# EAGLE design WillowCape_v1 (EAGLE 7.3.0)
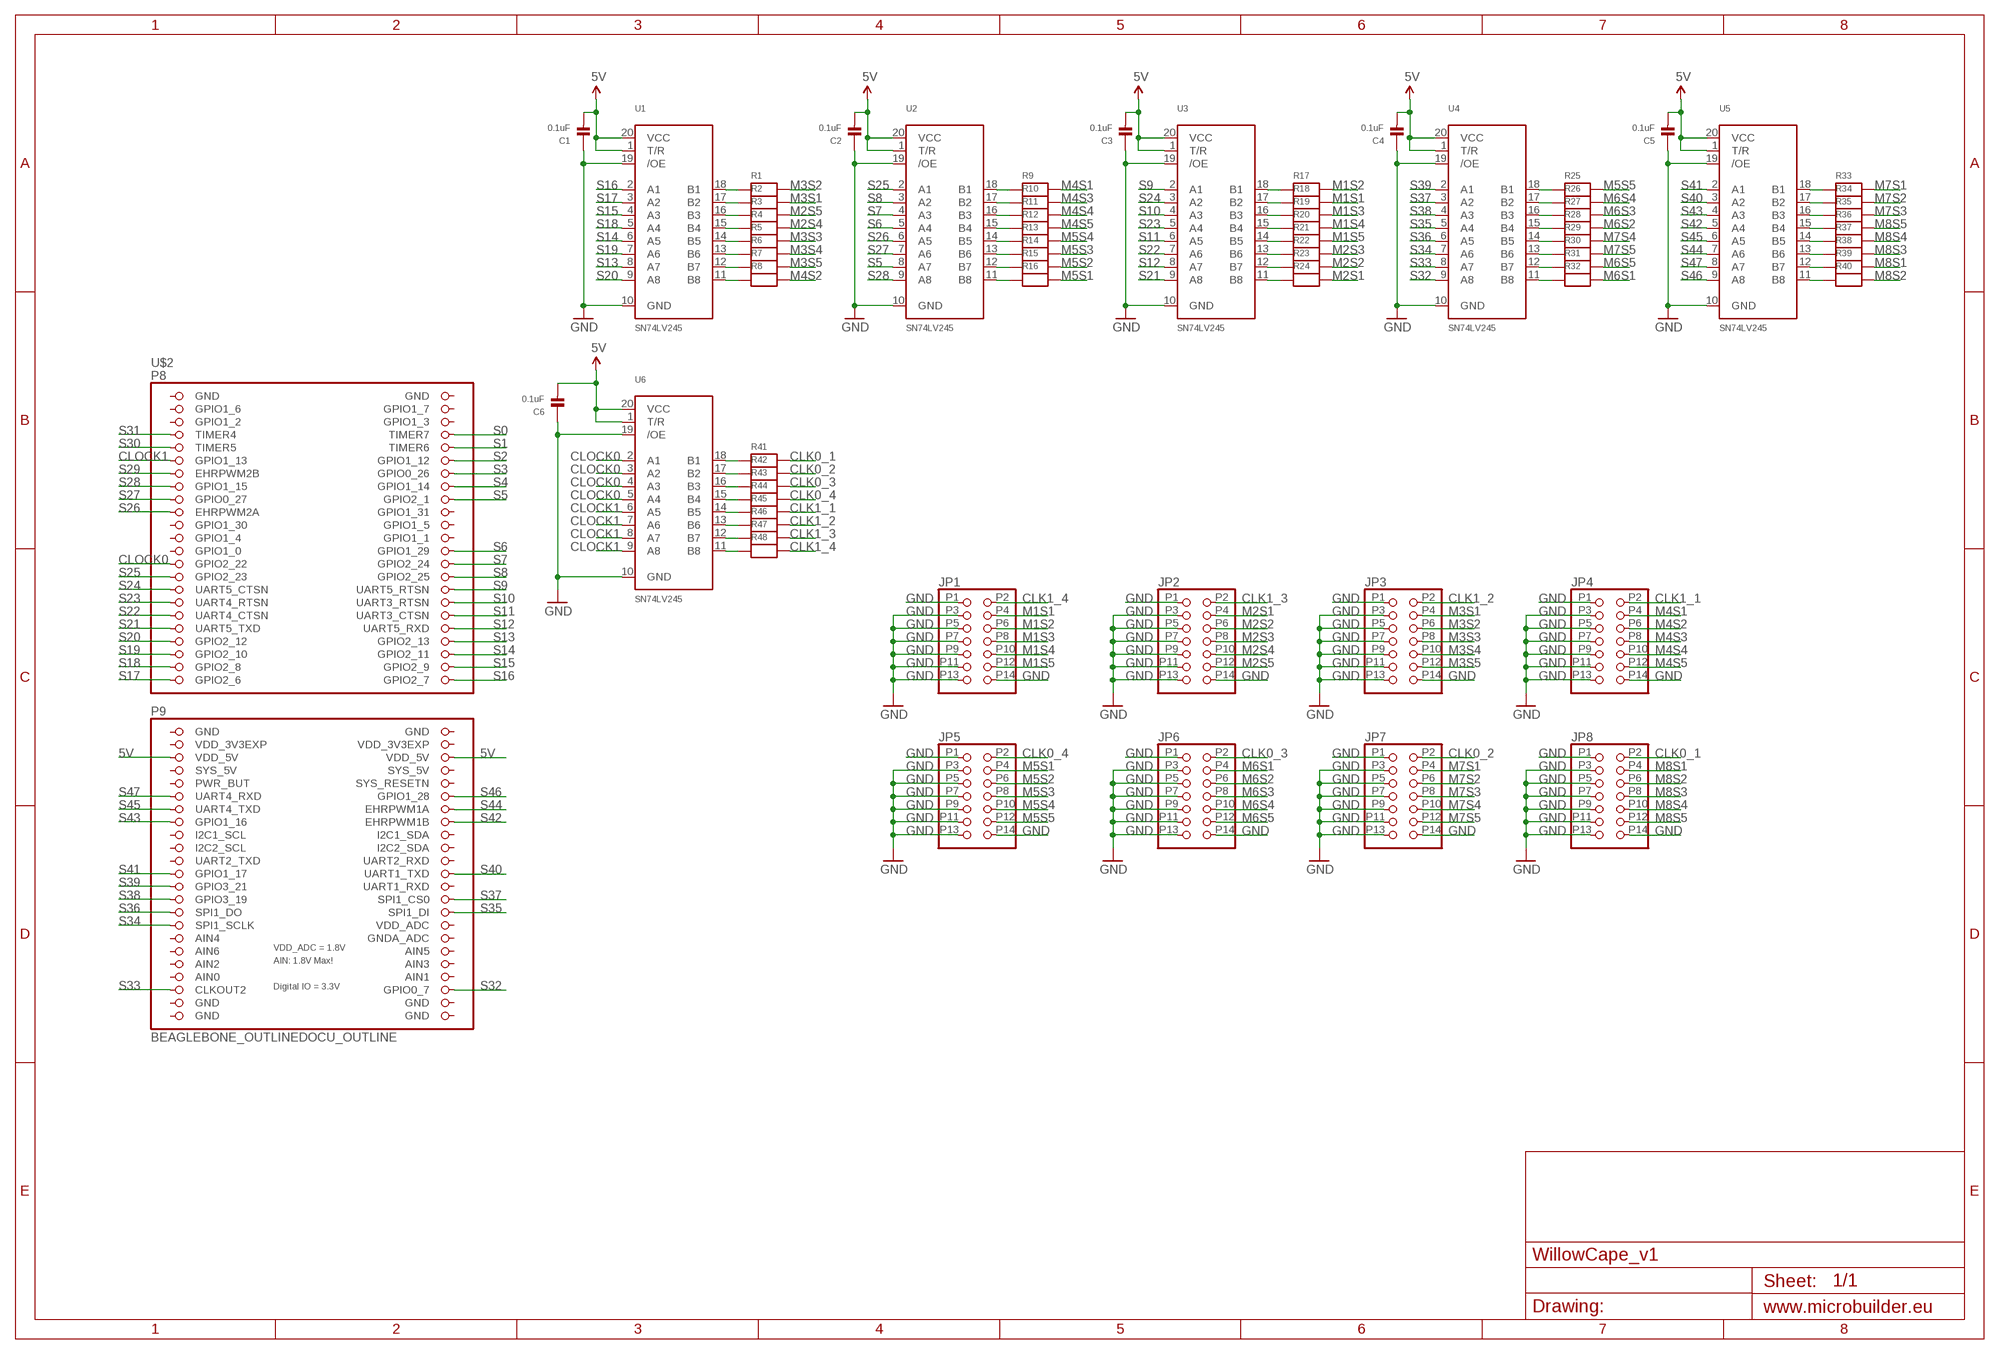
[diagram p0: schematic, sheet 1]

## Parts
C1  0.1uF  CAP_CERAMIC0603  [0603]
C2  0.1uF  CAP_CERAMIC0603  [0603]
C3  0.1uF  CAP_CERAMIC0603  [0603]
C4  0.1uF  CAP_CERAMIC0603  [0603]
C5  0.1uF  CAP_CERAMIC0603  [0603]
C6  0.1uF  CAP_CERAMIC0603  [0603]
JP1  IDC-BOX-HEADER  [IDC-BOX-HEADER]
JP2  IDC-BOX-HEADER  [IDC-BOX-HEADER]
JP3  IDC-BOX-HEADER  [IDC-BOX-HEADER]
JP4  IDC-BOX-HEADER  [IDC-BOX-HEADER]
JP5  IDC-BOX-HEADER  [IDC-BOX-HEADER]
JP6  IDC-BOX-HEADER  [IDC-BOX-HEADER]
JP7  IDC-BOX-HEADER  [IDC-BOX-HEADER]
JP8  IDC-BOX-HEADER  [IDC-BOX-HEADER]
R1  RESISTOR0603  [0603]
R2  RESISTOR0603  [0603]
R3  RESISTOR0603  [0603]
R4  RESISTOR0603  [0603]
R5  RESISTOR0603  [0603]
R6  RESISTOR0603  [0603]
R7  RESISTOR0603  [0603]
R8  RESISTOR0603  [0603]
R9  RESISTOR0603  [0603]
R10  RESISTOR0603  [0603]
R11  RESISTOR0603  [0603]
R12  RESISTOR0603  [0603]
R13  RESISTOR0603  [0603]
R14  RESISTOR0603  [0603]
R15  RESISTOR0603  [0603]
R16  RESISTOR0603  [0603]
R17  RESISTOR0603  [0603]
R18  RESISTOR0603  [0603]
R19  RESISTOR0603  [0603]
R20  RESISTOR0603  [0603]
R21  RESISTOR0603  [0603]
R22  RESISTOR0603  [0603]
R23  RESISTOR0603  [0603]
R24  RESISTOR0603  [0603]
R25  RESISTOR0603  [0603]
R26  RESISTOR0603  [0603]
R27  RESISTOR0603  [0603]
R28  RESISTOR0603  [0603]
R29  RESISTOR0603  [0603]
R30  RESISTOR0603  [0603]
R31  RESISTOR0603  [0603]
R32  RESISTOR0603  [0603]
R33  RESISTOR0603  [0603]
R34  RESISTOR0603  [0603]
R35  RESISTOR0603  [0603]
R36  RESISTOR0603  [0603]
R37  RESISTOR0603  [0603]
R38  RESISTOR0603  [0603]
R39  RESISTOR0603  [0603]
R40  RESISTOR0603  [0603]
R41  RESISTOR0603  [0603]
R42  RESISTOR0603  [0603]
R43  RESISTOR0603  [0603]
R44  RESISTOR0603  [0603]
R45  RESISTOR0603  [0603]
R46  RESISTOR0603  [0603]
R47  RESISTOR0603  [0603]
R48  RESISTOR0603  [0603]
U1  SN74LV245  74LCX245  [TSSOP20]
U2  SN74LV245  74LCX245  [TSSOP20]
U3  SN74LV245  74LCX245  [TSSOP20]
U4  SN74LV245  74LCX245  [TSSOP20]
U5  SN74LV245  74LCX245  [TSSOP20]
U6  SN74LV245  74LCX245  [TSSOP20]
U$2  BEAGLEBONE_OUTLINEDOCU_OUTLINE  [BEAGLEBONE_OUTLINE_DOCU]

## Nets
5V: C1.2 C2.2 C3.2 C4.2 C5.2 C6.2 U1.1(T/R) U1.20(VCC) U2.1(T/R) U2.20(VCC) U3.1(T/R) U3.20(VCC) U4.1(T/R) U4.20(VCC) U5.1(T/R) U5.20(VCC) U6.1(T/R) U6.20(VCC) U$2.51(VDD_5V) U$2.52(VDD_5V)
CLK0_1: JP8.P2 R41.2
CLK0_2: JP7.P2 R42.2
CLK0_3: JP6.P2 R43.2
CLK0_4: JP5.P2 R44.2
CLK1_1: JP4.P2 R45.2
CLK1_2: JP3.P2 R46.2
CLK1_3: JP2.P2 R47.2
CLK1_4: JP1.P2 R48.2
CLOCK0: U6.2(A1) U6.3(A2) U6.4(A3) U6.5(A4) U$2.27(GPIO2_22)
CLOCK1: U6.6(A5) U6.7(A6) U6.8(A7) U6.9(A8) U$2.11(GPIO1_13)
GND: C1.1 C2.1 C3.1 C4.1 C5.1 C6.1 JP1.P1 JP1.P3 JP1.P5 JP1.P7 JP1.P9 JP1.P11 JP1.P13 JP1.P14 JP2.P1 JP2.P3 JP2.P5 JP2.P7 JP2.P9 JP2.P11 JP2.P13 JP2.P14 JP3.P1 JP3.P3 JP3.P5 JP3.P7 JP3.P9 JP3.P11 JP3.P13 JP3.P14 JP4.P1 JP4.P3 JP4.P5 JP4.P7 JP4.P9 JP4.P11 JP4.P13 JP4.P14 JP5.P1 JP5.P3 JP5.P5 JP5.P7 JP5.P9 JP5.P11 JP5.P13 JP5.P14 JP6.P1 JP6.P3 JP6.P5 JP6.P7 JP6.P9 JP6.P11 JP6.P13 JP6.P14 JP7.P1 JP7.P3 JP7.P5 JP7.P7 JP7.P9 JP7.P11 JP7.P13 JP7.P14 JP8.P1 JP8.P3 JP8.P5 JP8.P7 JP8.P9 JP8.P11 JP8.P13 JP8.P14 U1.10(GND) U1.19(/OE) U2.10(GND) U2.19(/OE) U3.10(GND) U3.19(/OE) U4.10(GND) U4.19(/OE) U5.10(GND) U5.19(/OE) U6.10(GND) U6.19(/OE)
M1S1: JP1.P4 R18.2
M1S2: JP1.P6 R17.2
M1S3: JP1.P8 R19.2
M1S4: JP1.P10 R20.2
M1S5: JP1.P12 R21.2
M2S1: JP2.P4 R24.2
M2S2: JP2.P6 R23.2
M2S3: JP2.P8 R22.2
M2S4: JP2.P10 R4.2
M2S5: JP2.P12 R3.2
M3S1: JP3.P4 R2.2
M3S2: JP3.P6 R1.2
M3S3: JP3.P8 R5.2
M3S4: JP3.P10 R6.2
M3S5: JP3.P12 R7.2
M4S1: JP4.P4 R9.2
M4S2: JP4.P6 R8.2
M4S3: JP4.P8 R10.2
M4S4: JP4.P10 R11.2
M4S5: JP4.P12 R12.2
M5S1: JP5.P4 R16.2
M5S2: JP5.P6 R15.2
M5S3: JP5.P8 R14.2
M5S4: JP5.P10 R13.2
M5S5: JP5.P12 R25.2
M6S1: JP6.P4 R32.2
M6S2: JP6.P6 R28.2
M6S3: JP6.P8 R27.2
M6S4: JP6.P10 R26.2
M6S5: JP6.P12 R31.2
M7S1: JP7.P4 R33.2
M7S2: JP7.P6 R34.2
M7S3: JP7.P8 R35.2
M7S4: JP7.P10 R29.2
M7S5: JP7.P12 R30.2
M8S1: JP8.P4 R39.2
M8S2: JP8.P6 R40.2
M8S3: JP8.P8 R38.2
M8S4: JP8.P10 R37.2
M8S5: JP8.P12 R36.2
N$23: R1.1 U1.18(B1)
N$24: R2.1 U1.17(B2)
N$25: R3.1 U1.16(B3)
N$26: R4.1 U1.15(B4)
N$27: R5.1 U1.14(B5)
N$28: R6.1 U1.13(B6)
N$29: R7.1 U1.12(B7)
N$30: R8.1 U1.11(B8)
N$31: R9.1 U2.18(B1)
N$32: R10.1 U2.17(B2)
N$33: R11.1 U2.16(B3)
N$34: R12.1 U2.15(B4)
N$35: R13.1 U2.14(B5)
N$36: R14.1 U2.13(B6)
N$37: R15.1 U2.12(B7)
N$38: R16.1 U2.11(B8)
N$39: R17.1 U3.18(B1)
N$40: R18.1 U3.17(B2)
N$41: R19.1 U3.16(B3)
N$42: R20.1 U3.15(B4)
N$43: R21.1 U3.14(B5)
N$44: R22.1 U3.13(B6)
N$45: R23.1 U3.12(B7)
N$46: R24.1 U3.11(B8)
N$47: R25.1 U4.18(B1)
N$48: R26.1 U4.17(B2)
N$49: R27.1 U4.16(B3)
N$50: R28.1 U4.15(B4)
N$51: R29.1 U4.14(B5)
N$52: R30.1 U4.13(B6)
N$53: R31.1 U4.12(B7)
N$54: R32.1 U4.11(B8)
N$55: R33.1 U5.18(B1)
N$56: R34.1 U5.17(B2)
N$57: R35.1 U5.16(B3)
N$58: R36.1 U5.15(B4)
N$59: R37.1 U5.14(B5)
N$60: R38.1 U5.13(B6)
N$61: R39.1 U5.12(B7)
N$62: R40.1 U5.11(B8)
N$63: R41.1 U6.18(B1)
N$64: R42.1 U6.17(B2)
N$65: R43.1 U6.16(B3)
N$66: R44.1 U6.15(B4)
N$67: R45.1 U6.14(B5)
N$68: R46.1 U6.13(B6)
N$69: R47.1 U6.12(B7)
N$70: R48.1 U6.11(B8)
S0: U$2.8(TIMER7)
S1: U$2.10(TIMER6)
S2: U$2.12(GPIO1_12)
S3: U$2.14(GPIO0_26)
S4: U$2.16(GPIO1_14)
S5: U2.8(A7) U$2.18(GPIO2_1)
S6: U2.5(A4) U$2.26(GPIO1_29)
S7: U2.4(A3) U$2.28(GPIO2_24)
S8: U2.3(A2) U$2.30(GPIO2_25)
S9: U3.2(A1) U$2.32(UART5_RTSN)
S10: U3.4(A3) U$2.34(UART3_RTSN)
S11: U3.6(A5) U$2.36(UART3_CTSN)
S12: U3.8(A7) U$2.38(UART5_RXD)
S13: U1.8(A7) U$2.40(GPIO2_13)
S14: U1.6(A5) U$2.42(GPIO2_11)
S15: U1.4(A3) U$2.44(GPIO2_9)
S16: U1.2(A1) U$2.46(GPIO2_7)
S17: U1.3(A2) U$2.45(GPIO2_6)
S18: U1.5(A4) U$2.43(GPIO2_8)
S19: U1.7(A6) U$2.41(GPIO2_10)
S20: U1.9(A8) U$2.39(GPIO2_12)
S21: U3.9(A8) U$2.37(UART5_TXD)
S22: U3.7(A6) U$2.35(UART4_CTSN)
S23: U3.5(A4) U$2.33(UART4_RTSN)
S24: U3.3(A2) U$2.31(UART5_CTSN)
S25: U2.2(A1) U$2.29(GPIO2_23)
S26: U2.6(A5) U$2.19(EHRPWM2A)
S27: U2.7(A6) U$2.17(GPIO0_27)
S28: U2.9(A8) U$2.15(GPIO1_15)
S29: U$2.13(EHRPWM2B)
S30: U$2.9(TIMER5)
S31: U$2.7(TIMER4)
S32: U4.9(A8) U$2.88(GPIO0_7)
S33: U4.8(A7) U$2.87(CLKOUT2)
S34: U4.7(A6) U$2.77(SPI1_SCLK)
S35: U4.5(A4) U$2.76(SPI1_DI)
S36: U4.6(A5) U$2.75(SPI1_DO)
S37: U4.3(A2) U$2.74(SPI1_CS0)
S38: U4.4(A3) U$2.73(GPIO3_19)
S39: U4.2(A1) U$2.71(GPIO3_21)
S40: U5.3(A2) U$2.70(UART1_TXD)
S41: U5.2(A1) U$2.69(GPIO1_17)
S42: U5.5(A4) U$2.62(EHRPWM1B)
S43: U5.4(A3) U$2.61(GPIO1_16)
S44: U5.7(A6) U$2.60(EHRPWM1A)
S45: U5.6(A5) U$2.59(UART4_TXD)
S46: U5.9(A8) U$2.58(GPIO1_28)
S47: U5.8(A7) U$2.57(UART4_RXD)
Unconnected: U$2.3(GPIO1_6) U$2.4(GPIO1_7) U$2.5(GPIO1_2) U$2.6(GPIO1_3) U$2.20(GPIO1_31) U$2.21(GPIO1_30) U$2.22(GPIO1_5) U$2.23(GPIO1_4) U$2.24(GPIO1_1) U$2.25(GPIO1_0) U$2.55(PWR_BUT) U$2.56(SYS_RESETN) U$2.63(I2C1_SCL) U$2.64(I2C1_SDA) U$2.65(I2C2_SCL) U$2.66(I2C2_SDA) U$2.67(UART2_TXD) U$2.68(UART2_RXD) U$2.72(UART1_RXD) U$2.79(AIN4) U$2.81(AIN6) U$2.82(AIN5) U$2.83(AIN2) U$2.84(AIN3) U$2.85(AIN0) U$2.86(AIN1)

## Power pins joined to a net without a drawn wire
GND: U$2.1(GND) U$2.2(GND) U$2.47(GND) U$2.48(GND) U$2.89(GND) U$2.90(GND) U$2.91(GND) U$2.92(GND)
GNDA_ADC: U$2.80(GNDA_ADC)
SYS_5V: U$2.53(SYS_5V) U$2.54(SYS_5V)
VDD_3V3EXP: U$2.49(VDD_3V3EXP) U$2.50(VDD_3V3EXP)
VDD_ADC: U$2.78(VDD_ADC)

## Library data of the parts
C1-C6 = microbuilder:CAP_CERAMIC: Ceramic Capacitors 0402 - 0402 Surface Mount Capacitors 16pF 50V 5% [Digikey: 445-4899-2-ND] 18pF 50V 5% [Digikey: 490-1281-2-ND] 22pF 50V 5% [Digikey: 490-1283-2-ND] 68pF 50V 5% [Digikey: 490-1289-2-ND] 0.1uF 10V 10% [Digikey: 490-1318-2-ND] 1.0uF 6.3V 10% [Digikey: 490-1320-2-ND] 0603 - 0603 Surface Mount Capacitors 16 pF 50V 5% [Digikey: 445-5051-2-ND] 22 pF 50V [Digikey: PCC220ACVTR-ND] 33 pF 50V 5% [Digikey: 490-1415-1-ND] 56pF 50V 5% [Digikey: 490-1421-1-ND] 220pF 50V 5% [Digikey: 445-1285-1-ND] 680 pF 50V 2200 pF 50V 5% C0G [Digikey: 445-1297-1-ND] 5600 pF 100V 5% X7R [Digikey: 478-3711-1-ND] 0.1 µF 25V 10% [Digikey: PCC2277TR-ND] 0.22 µF 16V 10% X7R [Digikey: 445-1318-1-ND] 1.0 µF 25V 10% [Digikey: 445-5146-2-ND] 0603 - RF Specific 3pF 250V +/-0.1pF RF [Digikey: 712-1347-1-ND] 18 pF 250V 5% [Digikey: 478-3505-1-ND or 712-1322-1-ND] 56 pF 250V 5% C0G RF [Digikey: 490-4867-1-ND] 68 pF 250V RF [Digikey: 490-4868-1-ND] 0805 - 0805 Surface Mount Capacitors 220 pF 250V 2% RF Ceramic Capacitor [Digikey: 712-1398-1-ND] 1000 pF 50V 2% NP0 Ceramic Capacitor [Digikey: 478-3760-1-ND] 0.1 µF 25V 10% Ceramic Capacitor [Digikey: PCC1828TR-ND] 1.0 µF 16V 10% Ceramic Capacitor[Digikey: 490-1691-2-ND] 10.0 µF 10V 10% Ceramic Capacitor[Digikey: 709-1228-1-ND] 10.0 uF 16V 10% Ceramic Capacitor [Digikey: 478-5165-2-ND] 47 uF 6.3V 20% Ceramic Capacitor [Digikey: 587-1779-1-ND or 399-5506-1-ND] 1206 - 1206 Surface Mount Capacitors 47uF 10V 20% Ceramic Capacitor [Digikey: 490-5528-1-ND or 399-5508-1-ND or 445-6010-1-ND] 100uF 6.3V -20%, +80% Y5V Ceramic Capacitor (Digikey: 490-4512-1-ND, Mouser: 81-GRM31CF50J107ZE1L)
JP1-JP8 = Custom:IDC-BOX-HEADER
R1-R48 = microbuilder:RESISTOR: Resistors 0402 - 0402 Surface Mount Package 22 Ohm 1% 1/16W [Digikey: 311-22.0LRTR-ND] 33 Ohm 5% 1/16W 1.0K 5% 1/16W 1.5K 5% 1/16W 2.0K 1% 1/16W 10.0K 1% 1/16W [Digikey: 311-10.0KLRTR-ND] 10.0K 5% 1/16W [Digikey: RMCF0402JT10K0TR-ND] 12.1K 1% 1/16W [Digikey: 311-22.0LRTR-ND] 100.0K 5% 1/16W 0603 - 0603 Surface Mount Package 0 Ohm 1/10 Watt 1% Resistor 15 Ohm 1/10 Watt 1% Resistor 33 Ohm 1/10 Watt 1% Resistor 49.9 Ohm 1/10 Watt 1% Resistor 100 Ohm 1/10 Watt 1% Resistor 150 Ohm 1/10 Watt 1% Resistor 240 Ohm 1/10 Watt 1% Resistor 390 Ohm 1/10 Watt 1% Resistor 560 Ohm 1/10 Watt 1% Resistor 680 Ohm 1/10 Watt 1% Resistor 750 Ohm 1/10 Watt 1% Resistor 1.0K Ohm 1/10 Watt 1% Resistor 1.5K Ohm 1/10 Watt 1% Resistor 2.0K Ohm 1/10 Watt 1% Resistor 2.2K Ohm 1/10 Watt 1% Resistor 3.3K Ohm 1/10 Watt 1% Resistor 4.7K Ohm 1/10 Watt 1% Resistor 10.0K Ohm 1/10 Watt 1% Resistor 12.0K Ohm 1/10 Watt 1% Resistor 12.1K Ohm 1/10 Watt 1% Resistor 20.0K Ohm 1/10 Watt 1% Resistor 33.0K Ohm 1/10 Watt 1% Resistor 100.0K Ohm 1/10 Watt 1% Resistor 0805 - 0805 Surface Mount Package 0 Ohm 1/8 Watt 1% Resistor 33 Ohm 1/8 Watt 1% Resistor 100 Ohm 1/8 Watt 1% Resistor 150 Ohm 1/8 Watt 1% Resistor 200 Ohm 1/8 Watt 1% Resistor 240 Ohm 1/8 Watt 1% Resistor 330 Ohm 1/8 Watt 1% Resistor 390 Ohm 1/8 Watt 1% Resistor 470 Ohm 1/8 Watt 1% Resistor 1.0K Ohm 1/8 Watt 1% Resistor 1.5K Ohm 1/8 Watt 1% Resistor 2.0K Ohm 1/8 Watt 1% Resistor 4.7K Ohm 1/8 Watt 1% Resistor 5.1K Ohm 1/8 Watt 1% Resistor 5.6K Ohm 1/8 Watt 1% Resistor 10.0K Ohm 1/8 Watt 1% Resistor 22.0K Ohm 1/8 Watt 1% Resistor 33.0K Ohm 1/8 Watt 1% Resistor 100K Ohm 1/8 Watt 1% Resistor 1206 - 1206 Surface Mount Package 2012 - 2010 Surface Mount Package 0.11 Ohm 1/2 Watt 1% Resistor - Digikey: RHM.11UCT-ND
U1-U6 = microbuilder:74LCX245: 74LCX245MTC - 5.0V Tolerant Bi-Directional Buffer Can be used to interface 5.0V logic to 2.5 or 3.3V devices Digikey: 74LCX245MTCXTR-ND Mouser: 512-74LCX245MTCX
U$2 = microbuilder:BEAGLEBONE_OUTLINE

## Board
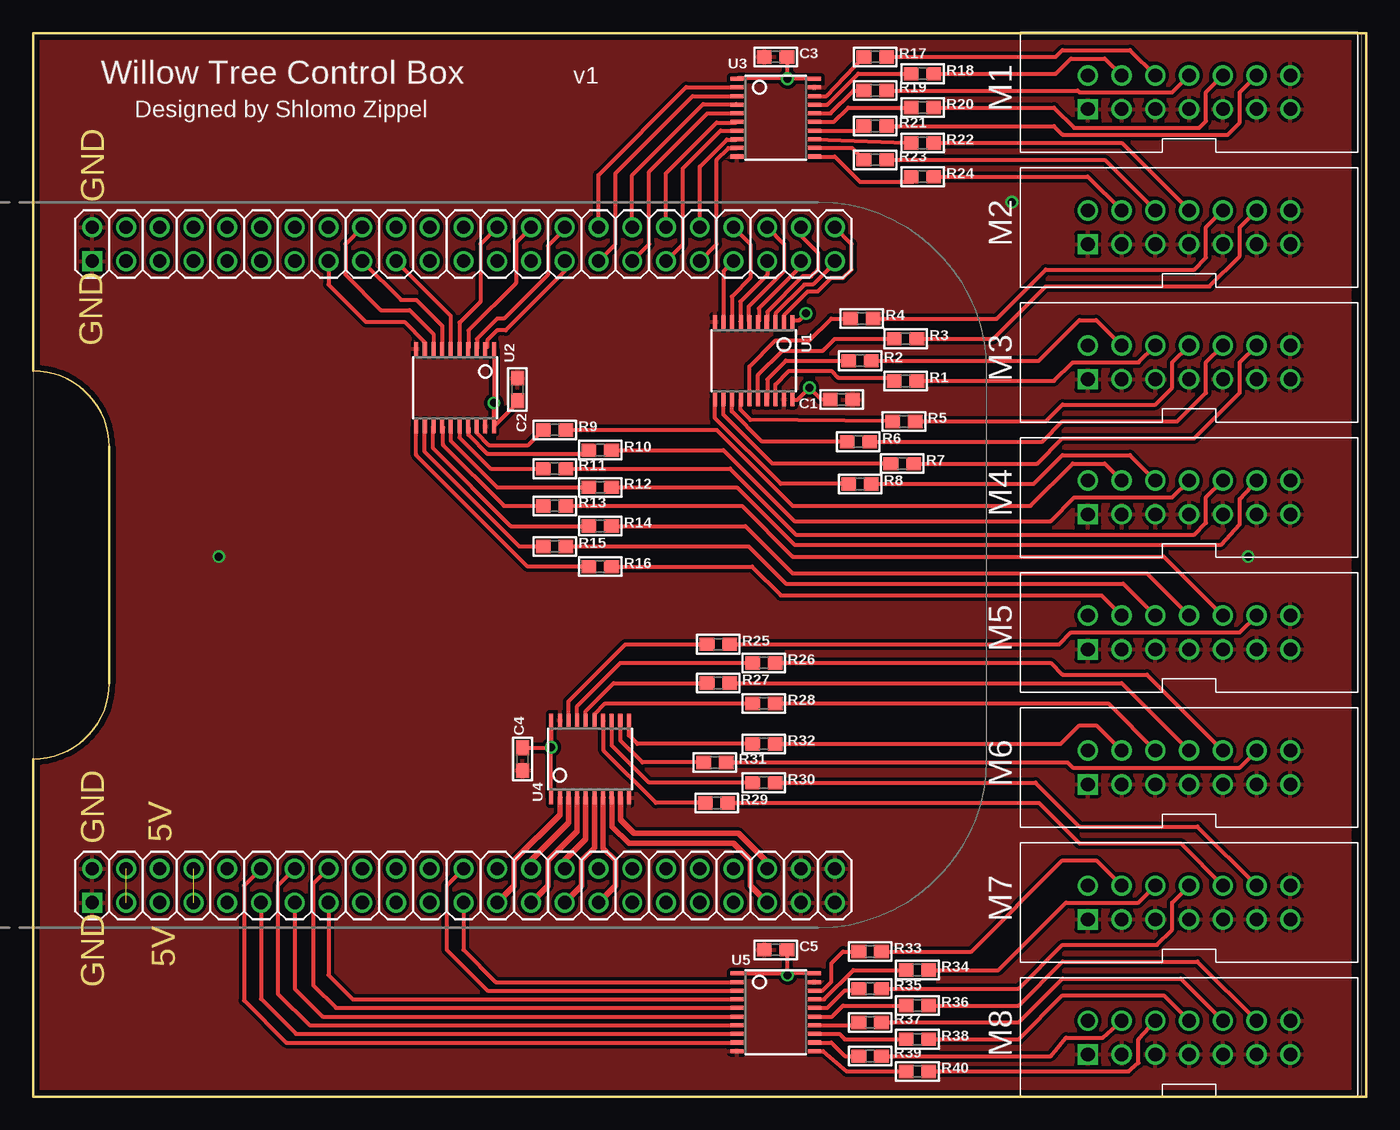
[diagram p1: board, top side]
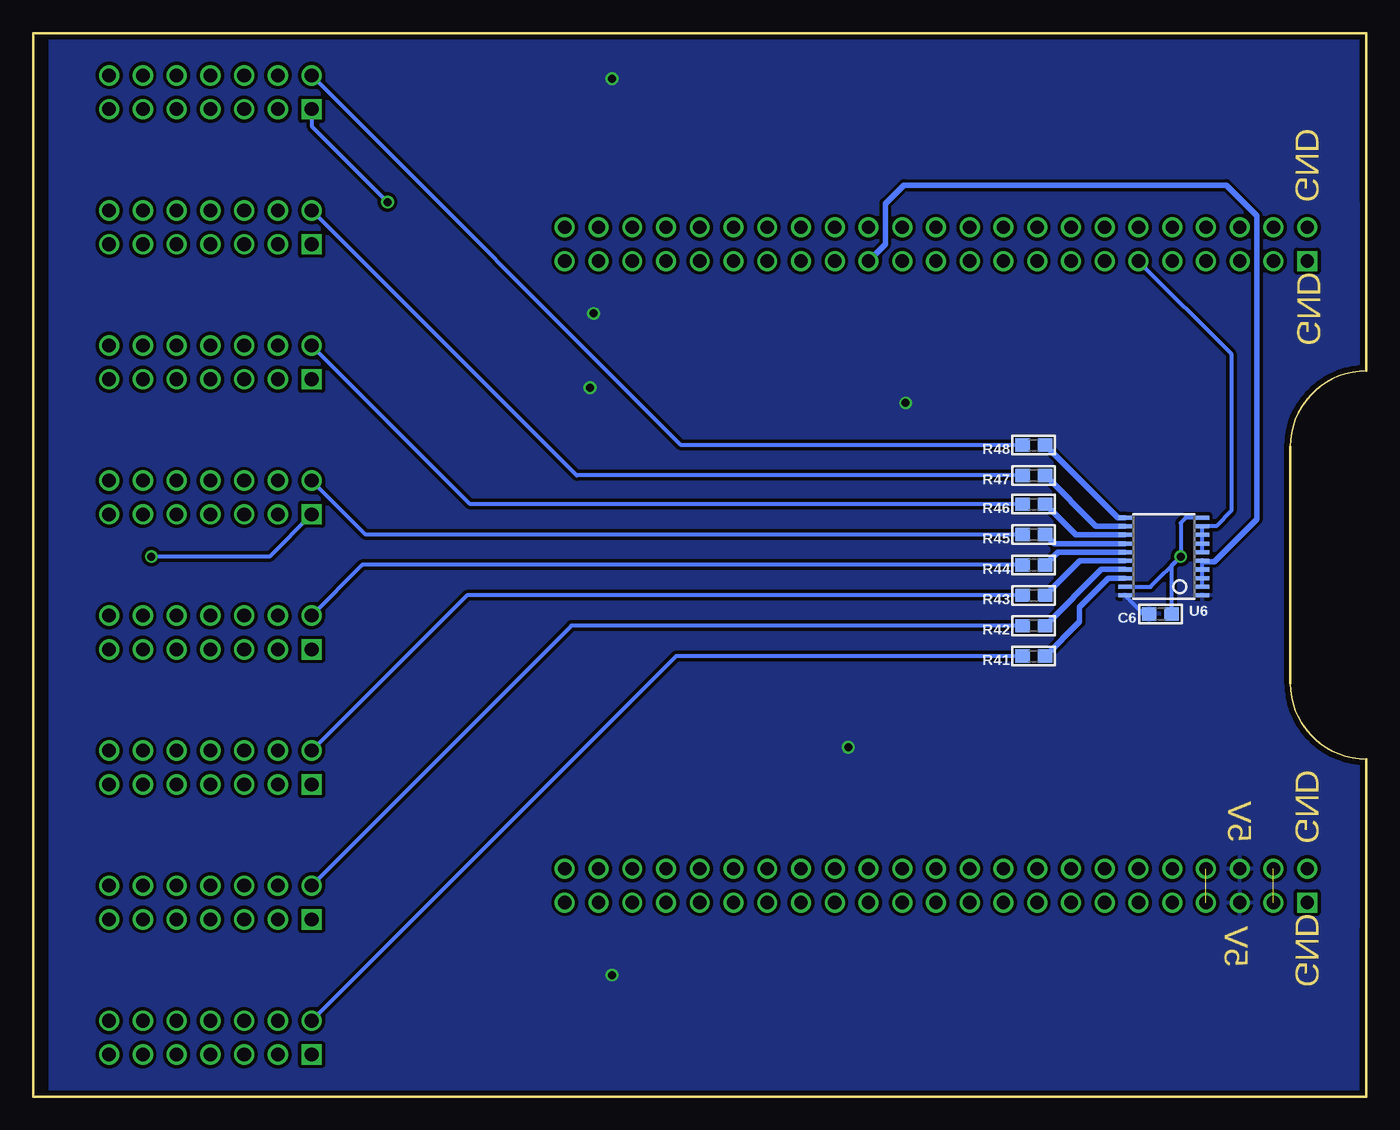
[diagram p2: board, bottom side, seen from below]

Size 100.33 x 80.01 mm. Coordinates in mm from the lower left corner, seen from the top.
Outline: 0,67.31 0,80.01 100.33,80.01 100.33,0 0,0 0,12.7
Copper layers (1*16): Top 0.0356mm / dielectric 1.5011mm / Bottom 0.0356mm
Design rules "oshpark-2layer *": minimum track width 6mil, minimum drill 13mil, track to track 10mil, track to pad 10mil, pad to pad 10mil, via to via 10mil, smd to smd 6mil, copper to edge 15mil, drill to drill 6mil, minimum pad ring 7mil, minimum via ring 7mil, stop-mask expansion 4mil, vias tented up to drill 0mil, thermal gap 10mil

### Footprints (pad centres in the part's own frame; a part is rotated, then mirrored left to right if it is on the bottom)
0603 = smd 1.1 x 1: 1 -0.85,0; 2 0.85,0
IDC-BOX-HEADER = drill 1.02 square: P1 -7.62,-1.27 | drill 1.02: P2 -7.62,1.27; P3 -5.08,-1.27; P4 -5.08,1.27; P5 -2.54,-1.27; P6 -2.54,1.27; P7 0,-1.27; P8 0,1.27; P9 2.54,-1.27; P10 2.54,1.27; P11 5.08,-1.27; P12 5.08,1.27; P13 7.62,-1.27; P14 7.62,1.27
TSSOP20 = smd 0.305 x 0.991: 1 -2.925,-2.918; 2 -2.275,-2.918; 3 -1.625,-2.918; 4 -0.975,-2.918; 5 -0.325,-2.918; 6 0.325,-2.918; 7 0.975,-2.918; 8 1.625,-2.918; 9 2.275,-2.918; 10 2.925,-2.918; 11 2.925,2.918; 12 2.275,2.918; 13 1.625,2.918; 14 0.975,2.918; 15 0.325,2.918; 16 -0.325,2.918; 17 -0.975,2.918; 18 -1.625,2.918; 19 -2.275,2.918; 20 -2.925,2.918
BEAGLEBONE_OUTLINE_DOCU = drill 1 square: 1 4.445,19.05; 47 52.705,19.05 | drill 1: 2 1.905,19.05; 3 4.445,21.59; 4 1.905,21.59; 5 4.445,24.13; 6 1.905,24.13; 7 4.445,26.67; 8 1.905,26.67; 9 4.445,29.21; 10 1.905,29.21; 11 4.445,31.75; 12 1.905,31.75; 13 4.445,34.29; 14 1.905,34.29; 15 4.445,36.83; 16 1.905,36.83; 17 4.445,39.37; 18 1.905,39.37; 19 4.445,41.91; 20 1.905,41.91; 21 4.445,44.45; 22 1.905,44.45; 23 4.445,46.99; 24 1.905,46.99; 25 4.445,49.53; 26 1.905,49.53; 27 4.445,52.07; 28 1.905,52.07; 29 4.445,54.61; 30 1.905,54.61; 31 4.445,57.15; 32 1.905,57.15; 33 4.445,59.69; 34 1.905,59.69; 35 4.445,62.23; 36 1.905,62.23; 37 4.445,64.77; 38 1.905,64.77; 39 4.445,67.31; 40 1.905,67.31; 41 4.445,69.85; 42 1.905,69.85; 43 4.445,72.39; 44 1.905,72.39; 45 4.445,74.93; 46 1.905,74.93; 48 50.165,19.05; 49 52.705,21.59; 50 50.165,21.59; 51 52.705,24.13; 52 50.165,24.13; 53 52.705,26.67; 54 50.165,26.67; 55 52.705,29.21; 56 50.165,29.21; 57 52.705,31.75; 58 50.165,31.75; 59 52.705,34.29; 60 50.165,34.29; 61 52.705,36.83; 62 50.165,36.83; 63 52.705,39.37; 64 50.165,39.37; 65 52.705,41.91; 66 50.165,41.91; 67 52.705,44.45; 68 50.165,44.45; 69 52.705,46.99; 70 50.165,46.99; 71 52.705,49.53; 72 50.165,49.53; 73 52.705,52.07; 74 50.165,52.07; 75 52.705,54.61; 76 50.165,54.61; 77 52.705,57.15; 78 50.165,57.15; 79 52.705,59.69; 80 50.165,59.69; 81 52.705,62.23; 82 50.165,62.23; 83 52.705,64.77; 84 50.165,64.77; 85 52.705,67.31; 86 50.165,67.31; 87 52.705,69.85; 88 50.165,69.85; 89 52.705,72.39; 90 50.165,72.39; 91 52.705,74.93; 92 50.165,74.93

### Placement (x,y rotation side)
C1  60.83,52.45 180 top
C2  36.45,53.21 270 top
C3  55.88,78.23 0 top
C4  36.83,25.4 90 top
C5  55.88,11.05 0 top
C6  15.49,36.32 180 bottom
JP1  87,75.56 0 top
JP2  87,65.41 0 top
JP3  87,55.24 0 top
JP4  87,45.09 0 top
JP5  87,34.92 0 top
JP6  87,24.77 0 top
JP7  87,14.61 0 top
JP8  87,4.45 0 top
R1  65.66,53.85 0 top
R2  62.23,55.37 0 top
R3  65.66,57.02 0 top
R4  62.36,58.55 0 top
R5  65.53,50.8 0 top
R6  62.1,49.28 0 top
R7  65.41,47.62 0 top
R8  62.23,46.1 0 top
R9  39.24,50.16 0 top
R10  42.67,48.64 0 top
R11  39.24,47.24 0 top
R12  42.67,45.85 0 top
R13  39.24,44.45 0 top
R14  42.67,42.93 0 top
R15  39.24,41.4 0 top
R16  42.67,39.88 0 top
R17  63.37,78.23 0 top
R18  66.93,76.96 0 top
R19  63.37,75.69 0 top
R20  66.93,74.42 0 top
R21  63.37,73.03 0 top
R22  66.93,71.75 0 top
R23  63.37,70.48 0 top
R24  66.93,69.22 0 top
R25  51.56,34.04 0 top
R26  54.99,32.64 0 top
R27  51.56,31.11 0 top
R28  54.99,29.59 0 top
R29  51.44,22.1 0 top
R30  54.99,23.62 0 top
R31  51.31,25.15 0 top
R32  54.99,26.54 0 top
R33  62.99,10.92 0 top
R34  66.55,9.53 0 top
R35  62.99,8.13 0 top
R36  66.55,6.86 0 top
R37  62.99,5.59 0 top
R38  66.55,4.32 0 top
R39  62.99,3.05 0 top
R40  66.55,1.91 0 top
R41  25.02,33.15 180 bottom
R42  25.02,35.43 180 bottom
R43  25.02,37.72 180 bottom
R44  25.02,40.01 180 bottom
R45  25.02,42.29 180 bottom
R46  25.02,44.58 180 bottom
R47  25.02,46.74 180 bottom
R48  25.02,49.02 180 bottom
U1  54.23,55.37 180 top
U2  31.75,53.34 180 top
U3  55.88,73.66 270 top
U4  41.91,25.4 0 top
U5  55.88,6.35 270 top
U6  15.24,40.64 90 bottom
U$2  -14.61,67.31 270 top

### Tracks (layer width: path | path; a pad name or v marks a point on that pad's centre or on a via)
5V  (via drill 0.6)
  Top 0.305: 58.5,9.28 U5.20 56.9,9.28 v56.77,9.14 | U1.20 57.53,52.45 v58.42,53.34 59.31,52.45 C1.2 | C5.2 56.73,9.18 v56.77,9.14 | U5.1 56.64,9.28 v56.77,9.14 | U4.20 v38.98,26.29 v38.99,26.29 | C4.2 38.95,26.25 v38.99,26.29 | U4.1 v38.98,26.29 v38.99,26.29 | C2.2 36.45,52.2 U2.20 v34.67,52.19 v34.67,52.2 U2.1 | U1.1 57.15,58.42 57.66,58.42 v58.17,58.93 | U3.20 v56.77,76.58 56.73,76.62 | C3.2 56.73,76.62 | 56.73,76.62 53,76.62 U3.1
  Bottom 0.305: C6.2 16.77,36.32 U6.20
  pour Bottom: 0,80.01 99.06,80.01 99.06,0 0,0 0,2.54
CLK0_1
  Bottom 0.305: R41.2 51.94,33.15 JP8.P2
CLK0_2
  Bottom 0.305: R42.2 59.82,35.43 JP7.P2
CLK0_3
  Bottom 0.305: R43.2 67.69,37.72 JP6.P2
CLK0_4
  Bottom 0.305: R44.2 75.56,40.01 JP5.P2
CLK1_1
  Bottom 0.305: R45.2 75.31,42.29 JP4.P2
CLK1_2
  Bottom 0.305: R46.2 67.44,44.58 JP3.P2
CLK1_3
  Bottom 0.305: R47.2 59.44,46.74 JP2.P2
CLK1_4
  Bottom 0.305: R48.2 51.56,49.02 JP1.P2
CLOCK0
  Bottom 0.305: U6.2 U6.3 U6.4 U6.5
  Bottom 0.406: U$2.27 36.2,64.14 36.2,67.18 34.8,68.58 10.54,68.58 8.26,66.29 8.26,43.43 11.43,40.26 12.27,40.26 U6.5
CLOCK1
  Bottom 0.305: U6.6 U6.7 U6.8 U6.9 12.31,42.93 11.3,42.93 10.16,44.07 10.16,55.88 U$2.11
GND  (via drill 0.6)
  Bottom 0.305: U6.10 13.59,43.56 13.97,43.18 v13.97,40.64 | C6.1 14.64,39.97 v13.97,40.64 | U6.19 16.25,38.37 v13.97,40.64 | JP1.P1 79.38,73.03 v73.66,67.31 | JP4.P1 82.55,40.64 v91.44,40.64
  pour Top: 0,80.01 99.06,80.01 99.06,0 0,0 0,2.54 0,67.31
M1S1
  Top 0.305: R18.2 76.96,76.96 78.11,78.11 80.64,78.11 JP1.P4
M1S2
  Top 0.305: R17.2 76.96,78.23 77.47,78.74 82.55,78.74 JP1.P6
M1S3
  Top 0.305: R19.2 78.61,75.69 78.74,75.56 85.72,75.56 JP1.P8
M1S4
  Top 0.305: R20.2 76.83,74.42 78.36,72.9 87.76,72.9 88.27,73.41 88.27,75.56 JP1.P10
M1S5
  Top 0.305: R21.2 76.83,73.03 77.47,72.39 89.92,72.39 90.81,73.28 90.81,75.56 JP1.P12
M2S1
  Top 0.305: R24.2 79.38,69.22 JP2.P4
M2S2
  Top 0.305: R23.2 80.64,70.48 JP2.P6
M2S3
  Top 0.305: R22.2 81.92,71.75 JP2.P8
M2S4
  Top 0.305: R4.2 72.52,58.55 76.2,62.23 87.38,62.23 88.27,63.12 88.27,65.41 JP2.P10
M2S5
  Top 0.305: R3.2 72.26,57.02 76.2,60.96 88.52,60.96 90.81,63.25 90.81,65.41 JP2.P12
M3S1
  Top 0.305: R2.2 75.69,55.37 78.74,58.42 80.01,58.42 JP3.P4
M3S2
  Top 0.305: R1.2 76.83,53.85 78.23,55.24 83.19,55.24 JP3.P6
M3S3
  Top 0.305: R5.2 76.2,50.8 77.47,52.07 84.45,52.07 85.72,53.34 85.72,55.24 JP3.P8
M3S4
  Top 0.305: R6.2 75.95,49.28 77.47,50.8 86.11,50.8 88.27,52.96 88.27,55.24 JP3.P10
M3S5
  Top 0.305: R7.2 75.56,47.62 77.47,49.53 87.38,49.53 90.81,52.96 90.81,55.24 JP3.P12
M4S1
  Top 0.305: JP4.P4 80.64,47.62 78.23,47.62 75.06,44.45 57.15,44.45 51.44,50.16 R9.2
M4S2
  Top 0.305: R8.2 75.31,46.1 77.47,48.26 82.55,48.26 JP4.P6
M4S3
  Top 0.305: R10.2 51.94,48.64 57.28,43.31 76.58,43.31 78.36,45.09 85.72,45.09 JP4.P8
M4S4
  Top 0.305: R11.2 52.45,47.24 57.4,42.29 87.38,42.29 88.27,43.18 88.27,45.09 JP4.P10
M4S5
  Top 0.305: R12.2 52.96,45.85 57.28,41.53 89.41,41.53 90.81,43.05 90.81,44.96 JP4.P12
M5S1
  Top 0.305: R16.2 54.1,39.88 56.26,37.72 80.39,37.72 JP5.P4
M5S2
  Top 0.305: R15.2 53.85,41.4 56.64,38.61 82.04,38.61 JP5.P6
M5S3
  Top 0.305: R14.2 53.59,42.93 57.15,39.37 83.82,39.37 JP5.P8
M5S4
  Top 0.305: R13.2 53.34,44.45 57.15,40.64 85.09,40.64 JP5.P10
M5S5
  Top 0.305: R25.2 77.22,34.04 78.11,34.92 90.81,34.92 JP5.P12
M6S1
  Top 0.305: R32.2 77.34,26.54 78.74,27.94 80.01,27.94 JP6.P4
M6S2
  Top 0.305: R28.2 80.9,29.59 JP6.P6
M6S3
  Top 0.305: R27.2 81.92,31.11 JP6.P8
M6S4
  Top 0.305: R26.2 76.58,32.64 77.47,31.75 83.82,31.75 JP6.P10
M6S5
  Top 0.305: R31.2 77.85,25.15 78.23,24.77 90.81,24.77 JP6.P12
M7S1
  Top 0.305: R33.2 70.61,10.92 77.47,17.78 80.01,17.78 JP7.P4
M7S2
  Top 0.305: R34.2 72.64,9.53 77.72,14.61 83.19,14.61 JP7.P6
M7S3
  Top 0.305: R35.2 74.17,8.13 77.47,11.43 84.58,11.43 85.72,12.57 85.72,14.61 JP7.P8
M7S4
  Top 0.305: R29.2 75.69,22.1 78.74,19.05 86.36,19.05 JP7.P10
M7S5
  Top 0.305: R30.2 75.44,23.62 78.74,20.32 87.63,20.32 JP7.P12
M8S1
  Top 0.305: R39.2 76.58,3.05 77.72,4.45 80.52,4.45 JP8.P4
M8S2
  Top 0.305: R40.2 82.42,1.91 83.19,2.54 83.19,4.32 JP8.P6
M8S3
  Top 0.305: R38.2 74.17,4.32 77.47,7.62 85.09,7.62 JP8.P8
M8S4
  Top 0.305: R37.2 74.17,5.59 77.47,8.89 86.36,8.89 JP8.P10
M8S5
  Top 0.305: R36.2 74.17,6.86 77.47,10.16 87.63,10.16 JP8.P12
N$23
  Top 0.305: U1.18 55.85,53.57 56.9,54.61 60.07,54.61 60.58,54.1 64.56,54.1 R1.1
N$24
  Top 0.305: U1.17 55.24,52.49 55.24,53.98 56.64,55.37 R2.1
N$25
  Top 0.305: U1.16 54.55,54.3 56.39,56.13 59.44,56.13 60.33,57.02 R3.1
N$26
  Top 0.305: U1.15 53.9,54.92 55.88,56.9 58.42,56.9 60.07,58.55 R4.1
N$27
  Top 0.305: R5.1 53.98,50.93 53.21,51.69 53.21,52.41 U1.14
N$28
  Top 0.305: R6.1 54.86,49.28 52.58,51.56 52.58,52.43 U1.13
N$29
  Top 0.305: R7.1 55.63,47.62 51.94,51.31 U1.12
N$30
  Top 0.305: R8.1 56.26,46.1 51.31,51.05 U1.11
N$31
  Top 0.305: U2.18 33.38,49.94 34.29,49.02 37.25,49.02 R9.1
N$32
  Top 0.305: U2.17 32.77,50.38 32.77,49.78 34.16,48.39 41.57,48.39 R10.1
N$33
  Top 0.305: U2.16 32.08,49.59 34.42,47.24 R11.1
N$34
  Top 0.305: U2.15 31.43,49.35 34.92,45.85 R12.1
N$35
  Top 0.305: U2.14 30.86,50.34 30.86,49.02 35.43,44.45 R13.1
N$36
  Top 0.305: U2.13 30.1,50.4 30.1,48.77 35.94,42.93 R14.1
N$37
  Top 0.305: U2.12 29.46,50.41 29.46,48.51 36.58,41.4 R15.1
N$38
  Top 0.305: R16.1 37.21,39.88 28.83,48.26 U2.11
N$39
  Top 0.305: U3.18 59.7,75.28 R17.1
N$40
  Top 0.305: U3.17 59.78,74.64 62.1,76.96 R18.1
N$41
  Top 0.305: U3.16 60.02,73.98 61.72,75.69 R19.1
N$42
  Top 0.305: U3.15 60.25,73.33 61.34,74.42 R20.1
N$43
  Top 0.305: U3.14 62.18,72.69 R21.1
N$44
  Top 0.305: U3.13 65.8,71.78 R22.1
N$45
  Top 0.305: U3.12 61.62,71.39 R23.1
N$46
  Top 0.305: U3.11 60.33,70.73 62.23,68.83 66.21,68.83 R24.1
N$47
  Top 0.305: U4.18 40.28,29.74 44.58,34.04 R25.1
N$48
  Top 0.305: U4.17 40.94,29.38 44.2,32.64 R26.1
N$49
  Top 0.305: U4.16 41.59,29.01 43.69,31.11 R27.1
N$50
  Top 0.305: U4.15 42.23,28.77 43.05,29.59 R28.1
N$51
  Top 0.305: R29.1 46.86,22.1 42.93,26.04 42.93,28.28 U4.14
N$52
  Top 0.305: R30.1 46.35,23.62 43.56,26.42 43.56,28.29 U4.13
N$53
  Top 0.305: R31.1 45.85,25.15 44.2,26.8 44.2,28.31 U4.12
N$54
  Top 0.305: R32.1 45.47,26.54 44.83,27.18 U4.11
N$55
  Top 0.305: U5.18 59.41,7.97 60.07,8.64 60.07,10.03 60.96,10.92 R33.1
N$56
  Top 0.305: U5.17 59.52,7.33 61.72,9.53 R34.1
N$57
  Top 0.305: U5.16 59.76,6.67 61.09,8 62.02,8 R35.1
N$58
  Top 0.305: U5.15 60.13,6.03 60.96,6.86 R36.1
N$59
  Top 0.305: U5.14 61.93,5.38 R37.1
N$60
  Top 0.305: U5.13 60.68,4.72 61.09,4.32 R38.1
N$61
  Top 0.305: U5.12 60.06,4.08 61.09,3.05 R39.1
N$62
  Top 0.305: U5.11 59.44,3.42 61.21,1.91 R40.1
N$63
  Bottom 0.406: U6.18 19.41,39.02 21.59,36.83 21.59,35.73 R41.1
N$64
  Bottom 0.406: U6.17 19.94,39.66 R42.1
N$65
  Bottom 0.406: U6.16 21.57,40.31 R43.1
N$66
  Bottom 0.406: U6.15 23.21,40.97 R44.1
N$67
  Bottom 0.406: U6.14 23.49,41.62 R45.1
N$68
  Bottom 0.406: U6.13 21.86,42.27 R46.1
N$69
  Bottom 0.406: U6.12 20.35,42.91 R47.1
N$70
  Bottom 0.406: U6.11 18.71,43.56 R48.1
S5
  Top 0.305: U$2.18 23.5,64.14 23.5,61.85 26.16,59.18 28.32,59.18 30.12,57.38 U2.8
S6
  Top 0.305: U$2.26 33.66,64.14 33.66,59.82 32.08,58.24 U2.5
S7
  Top 0.305: U$2.28 36.32,64.26 36.32,61.21 32.77,57.66 32.77,56.3 U2.4
S8
  Top 0.305: U$2.30 40.01,65.28 38.73,64.01 38.73,61.85 35.43,58.55 34.92,58.55 33.4,57.02 33.4,56.28 U2.3
S9
  Top 0.305: U$2.32 42.55,69.34 49.15,75.95 U3.2
S10
  Top 0.305: U$2.34 45.09,69.34 50.42,74.68 52.92,74.68 U3.4
S11
  Top 0.305: U$2.36 47.62,69.47 51.44,73.28 52.91,73.28 U3.6
S12
  Top 0.305: U$2.38 50.16,69.98 52.2,72.01 52.94,72.01 U3.8
S13
  Top 0.305: U$2.40 53.98,64.14 53.98,61.59 52.58,60.2 52.6,60.17 U1.8
S14
  Top 0.305: U$2.42 56.52,64.14 56.52,62.1 53.85,59.44 53.85,58.35 U1.6
S15
  Top 0.305: U$2.44 57.78,64.77 59.05,63.5 59.05,62.23 58.55,61.72 57.91,61.72 55.24,59.05 55.24,58.33 U1.4
S16
  Top 0.305: U1.2 56.5,58.79 58.29,60.58 59.05,60.58 60.07,61.59 60.96,61.59 61.59,62.23 61.59,64.14 U$2.46
S17
  Top 0.305: U$2.45 60.33,62.74 58.67,61.09 58.04,61.09 55.88,58.93 55.88,58.32 U1.3
S18
  Top 0.305: U$2.43 57.78,62.48 54.61,59.31 54.61,58.35 U1.5
S19
  Top 0.305: U$2.41 55.24,61.85 53.21,59.82 53.21,58.33 U1.7
S20
  Top 0.305: U$2.39 51.95,62.11 U1.9
S21
  Top 0.305: U$2.37 51.44,64.14 51.44,70.48 52.32,71.37 U3.9
S22
  Top 0.305: U$2.35 48.9,64.14 48.9,69.85 51.73,72.69 U3.7
S23
  Top 0.305: U$2.33 46.35,64.14 46.35,69.6 50.74,73.98 U3.5
S24
  Top 0.305: U$2.31 43.81,64.14 43.81,69.47 49.63,75.28 U3.3
S25
  Top 0.305: U$2.29 40.01,62.1 35.56,57.66 34.92,57.66 34.16,56.9 34.16,56.4 U2.2
S26
  Top 0.305: U$2.19 31.43,58.74 U2.6
S27
  Top 0.305: U$2.17 27.69,59.94 28.83,59.94 30.77,58 U2.7
S28
  Top 0.305: U$2.15 22.23,61.09 25.02,58.29 27.94,58.29 29.48,56.76 U2.9
S32
  Top 0.406: U$2.88 55.24,17.65 53.09,19.81 45.21,19.81 44.2,20.83 44.2,22.47 U4.9
S33
  Top 0.406: U$2.87 53.98,15.88 53.98,17.78 52.7,19.05 44.83,19.05 43.56,20.32 43.56,22.46 U4.8
S34
  Top 0.406: U$2.77 43.81,15.88 43.81,17.78 42.88,18.71 U4.7
S35
  Top 0.406: U$2.76 40.01,17.78 41.59,19.36 U4.5
S36
  Top 0.406: U$2.75 41.27,15.88 41.27,17.78 42.23,18.74 U4.6
S37
  Top 0.406: U$2.74 37.47,17.78 40.28,20.6 U4.3
S38
  Top 0.406: U$2.73 38.73,15.88 38.73,17.78 40.94,19.98 U4.4
S39
  Top 0.406: U$2.71 36.2,15.88 36.2,17.78 39.63,21.22 U4.2
S40
  Top 0.305: U$2.70 31.11,15.88 31.11,11.05 34.19,7.97 U5.3
S41
  Top 0.305: U$2.69 32.38,11.05 34.81,8.62 U5.2
S42
  Top 0.305: U$2.62 21.08,16 21.08,8.38 22.79,6.67 U5.5
S43
  Top 0.305: U$2.61 22.23,9.14 24.04,7.33 U5.4
S44
  Top 0.305: U$2.60 18.41,15.88 18.41,7.75 20.79,5.38 U5.7
S45
  Top 0.305: U$2.59 19.68,8.13 21.79,6.03 U5.6
S46
  Top 0.305: U$2.58 15.88,15.88 15.88,7.24 19.04,4.08 U5.9
S47
  Top 0.305: U$2.57 17.14,7.37 19.79,4.72 U5.8
SYS_5V  (1 unrouted)
VDD_3V3EXP  (1 unrouted)

### Text on the board
Dimension: GND | GND | GND | 5V | 5V | GND
tPlace: Willow Tree Control Box | v1 | Designed by Shlomo Zippel | M1 | M2 | M3 | M4 | M5 | M6 | M7 | M8